# Altium project klor1_4.PrjPcb
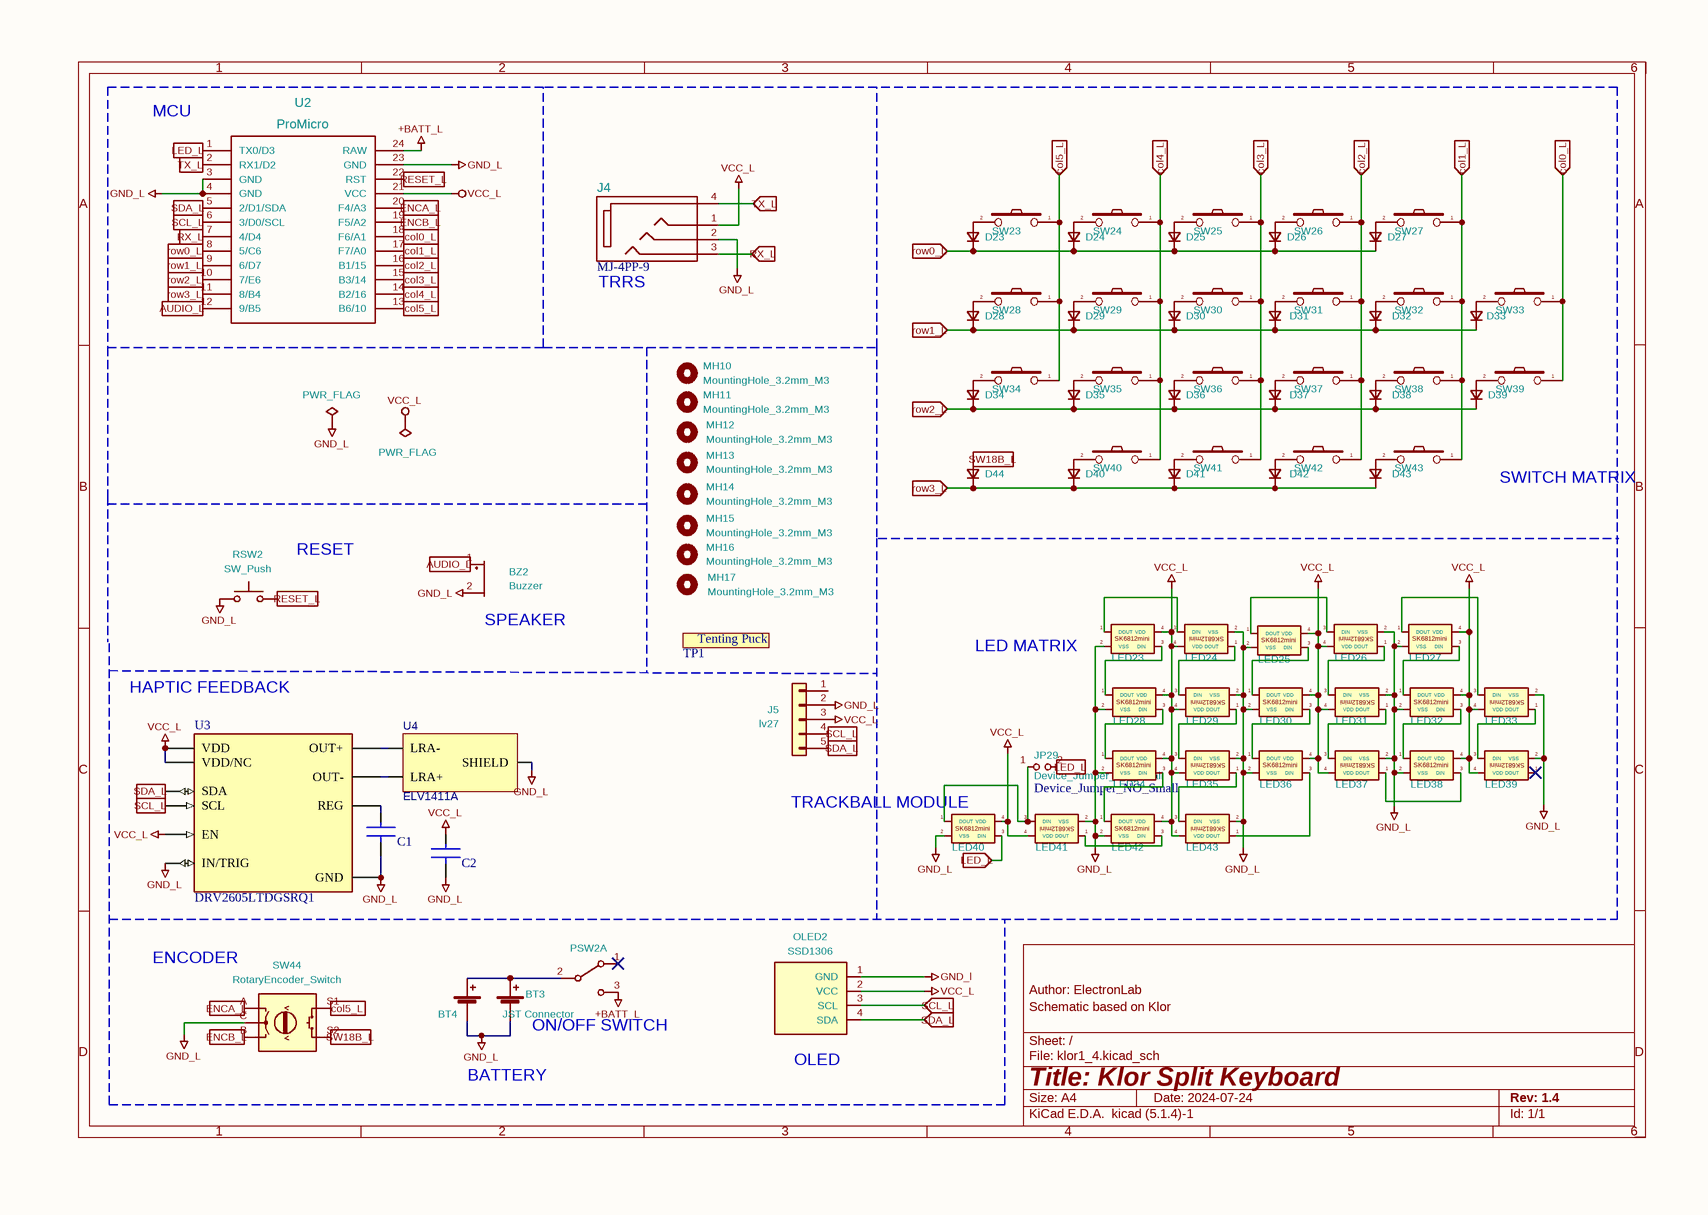
[diagram p0: klor1_4_L.SchDoc]
2 sheets, 178 parts. Net scope: flat (ports and power ports of the same name join across sheets).
Board file: klor1_4.PcbDoc
Sheets:
  klor1_4_L.SchDoc
  klor1_4_R.SchDoc

## Sheet klor1_4_L.SchDoc
size 297 x 209 mm

### Parts
#FLG01#1  PWR_FLAG  (graphical)
#FLG02#1  PWR_FLAG  (graphical)
BT3  JST Connector  [JST_PH_2PINS]
BT4  Battery_Cell  [custombatteryconnector_small]  (value not drawn)
BZ2  Buzzer  [Buzzer_Mallory_AST1109MLTRQ_reversible]
C1  Capacitor  [FP-C0402-BB-MFG]  (value not drawn)
C2  Capacitor  [FP-C0402-BB-MFG]  (value not drawn)
D23  D_Small  [Diode_SOD123]  (value not drawn)
D24  D_Small  [Diode_SOD123]  (value not drawn)
D25  D_Small  [Diode_SOD123]  (value not drawn)
D26  D_Small  [Diode_SOD123]  (value not drawn)
D27  D_Small  [Diode_SOD123]  (value not drawn)
D28  D_Small  [Diode_SOD123]  (value not drawn)
D29  D_Small  [Diode_SOD123]  (value not drawn)
D30  D_Small  [Diode_SOD123]  (value not drawn)
D31  D_Small  [Diode_SOD123]  (value not drawn)
D32  D_Small  [Diode_SOD123]  (value not drawn)
D33  D_Small  [Diode_SOD123]  (value not drawn)
D34  D_Small  [Diode_SOD123]  (value not drawn)
D35  D_Small  [Diode_SOD123]  (value not drawn)
D36  D_Small  [Diode_SOD123]  (value not drawn)
D37  D_Small  [Diode_SOD123]  (value not drawn)
D38  D_Small  [Diode_SOD123]  (value not drawn)
D39  D_Small  [Diode_SOD123]  (value not drawn)
D40  D_Small  [Diode_SOD123]  (value not drawn)
D41  D_Small  [Diode_SOD123]  (value not drawn)
D42  D_Small  [Diode_SOD123]  (value not drawn)
D43  D_Small  [Diode_SOD123]  (value not drawn)
D44  D_Small  [Diode_SOD123]  (value not drawn)
J4  MJ-4PP-9  [MJ-4PP-9]
J5  value lv27  [lvc27_onlyInput]  (hidden comment: lv2)
JP29  Device_Jumper_NO_Small  [SolderJumper-2_P1.3mm_Open_TrianglePad1.0x1.5mm]
LED23  SK6812MINI-E  [SK6812MINI-E]  (value not drawn)
LED24  SK6812MINI-E  [SK6812MINI-E]  (value not drawn)
LED25  SK6812MINI-E  [SK6812MINI-E]  (value not drawn)
LED26  SK6812MINI-E  [SK6812MINI-E]  (value not drawn)
LED27  SK6812MINI-E  [SK6812MINI-E]  (value not drawn)
LED28  SK6812MINI-E  [SK6812MINI-E]  (value not drawn)
LED29  SK6812MINI-E  [SK6812MINI-E]  (value not drawn)
LED30  SK6812MINI-E  [SK6812MINI-E]  (value not drawn)
LED31  SK6812MINI-E  [SK6812MINI-E]  (value not drawn)
LED32  SK6812MINI-E  [SK6812MINI-E]  (value not drawn)
LED33  SK6812MINI-E  [SK6812MINI-E]  (value not drawn)
LED34  SK6812MINI-E  [SK6812MINI-E]  (value not drawn)
LED35  SK6812MINI-E  [SK6812MINI-E]  (value not drawn)
LED36  SK6812MINI-E  [SK6812MINI-E]  (value not drawn)
LED37  SK6812MINI-E  [SK6812MINI-E]  (value not drawn)
LED38  SK6812MINI-E  [SK6812MINI-E]  (value not drawn)
LED39  SK6812MINI-E  [SK6812MINI-E]  (value not drawn)
LED40  SK6812MINI-E  [SK6812MINI-E]  (value not drawn)
LED41  SK6812MINI-E  [SK6812MINI-E]  (value not drawn)
LED42  SK6812MINI-E  [SK6812MINI-E]  (value not drawn)
LED43  SK6812MINI-E  [SK6812MINI-E]  (value not drawn)
MH10  MountingHole_3.2mm_M3  [MountingHole_3.2mm_M3]
MH11  MountingHole_3.2mm_M3  [MountingHole_3.2mm_M3]
MH12  MountingHole_3.2mm_M3  [MountingHole_3.2mm_M3]
MH13  MountingHole_3.2mm_M3  [MountingHole_3.2mm_M3]
MH14  MountingHole_3.2mm_M3  [MountingHole_3.2mm_M3]
MH15  MountingHole_3.2mm_M3  [MountingHole_3.2mm_M3]
MH16  MountingHole_3.2mm_M3  [MountingHole_3.2mm_M3]
MH17  MountingHole_3.2mm_M3  [MountingHole_3.2mm_M3]
OLED2  SSD1306  [SSD1306_128x64OLED]
PSW2  SW_DPDT_x2  [SW_MSK12C02]  (value not drawn)  (part A of 2)
RSW2  SW_Push  [SW_Push_1P1T-MP_NO_Horizontal_Alps_SKRTLAE010_both_sides]
SW23  SW_PUSH-MX  [CHERRY-CPG151101S11]  (value not drawn)
SW24  SW_PUSH-MX  [CHERRY-CPG151101S11]  (value not drawn)
SW25  SW_PUSH-MX  [CHERRY-CPG151101S11]  (value not drawn)
SW26  SW_PUSH-MX  [CHERRY-CPG151101S11]  (value not drawn)
SW27  SW_PUSH-MX  [CHERRY-CPG151101S11]  (value not drawn)
SW28  SW_PUSH-MX  [CHERRY-CPG151101S11]  (value not drawn)
SW29  SW_PUSH-MX  [CHERRY-CPG151101S11]  (value not drawn)
SW30  SW_PUSH-MX  [CHERRY-CPG151101S11]  (value not drawn)
SW31  SW_PUSH-MX  [CHERRY-CPG151101S11]  (value not drawn)
SW32  SW_PUSH-MX  [CHERRY-CPG151101S11]  (value not drawn)
SW33  SW_PUSH-MX  [CHERRY-CPG151101S11]  (value not drawn)
SW34  SW_PUSH-MX  [CHERRY-CPG151101S11]  (value not drawn)
SW35  SW_PUSH-MX  [CHERRY-CPG151101S11]  (value not drawn)
SW36  SW_PUSH-MX  [CHERRY-CPG151101S11]  (value not drawn)
SW37  SW_PUSH-MX  [CHERRY-CPG151101S11]  (value not drawn)
SW38  SW_PUSH-MX  [CHERRY-CPG151101S11]  (value not drawn)
SW39  SW_PUSH-MX  [CHERRY-CPG151101S11]  (value not drawn)
SW40  SW_PUSH-MX  [CHERRY-CPG151101S11]  (value not drawn)
SW41  SW_PUSH-MX  [CHERRY-CPG151101S11]  (value not drawn)
SW42  SW_PUSH-MX  [CHERRY-CPG151101S11]  (value not drawn)
SW43  SW_PUSH-MX  [CHERRY-CPG151101S11]  (value not drawn)
SW44  RotaryEncoder_Switch  [RotaryEncoder_Alps_EC11E-Switch_Vertical_H20mm-keebio_modified]
TP1  tenting-puck  [SplitkbTentingPuckWithoutCenterHole]  (value not drawn)
U2  ProMicro  [ProMicro]
U3  DRV2605LTDGSRQ1  [FP-DGS0010A-MFG]
U4  ELV1411A  [SMD-16_ELV1411A]

### Ports
AUDIO_L (in), col0_L (in), col1_L (in), col2_L (in), col3_L (in), col4_L (in), col5_L (in), ENCA_L (in), ENCB_L (in), LED_L (in), RESET_L (in), row0_L (in), row1_L (in), row2_L (in), row3_L (in), RX_L (in), SCL_L (in), SDA_L (in), SW18B_L (in), TX_L (in)

### Nets
+BATT_L: PSW2.3(C) U2.24(RAW)
GND_L: #FLG01#1.1(pwr) BT3.2(-) BT4.2(-) BZ2.2(+) C1.2 C2.2 J4.2 J5.2(Pin_2) LED23.2(VSS) LED24.2(VSS) LED25.2(VSS) LED26.2(VSS) LED27.2(VSS) LED28.2(VSS) LED29.2(VSS) LED30.2(VSS) LED31.2(VSS) LED32.2(VSS) LED33.2(VSS) LED34.2(VSS) LED35.2(VSS) LED36.2(VSS) LED37.2(VSS) LED38.2(VSS) LED39.2(VSS) LED40.2(VSS) LED41.2(VSS) LED42.2(VSS) LED43.2(VSS) OLED2.1(GND) RSW2.1 SW44.C U2.3(GND) U2.4(GND) U2.23(GND) U3.4(IN/TRIG) U3.8(GND) U4.5,6,7,8,9,10,11,12,13,14,15,16(SHIELD)
VCC_L: #FLG02#1.1(pwr) C2.1 J4.1 J5.3(Pin_3) LED23.4(VDD) LED24.4(VDD) LED25.4(VDD) LED26.4(VDD) LED27.4(VDD) LED28.4(VDD) LED29.4(VDD) LED30.4(VDD) LED31.4(VDD) LED32.4(VDD) LED33.4(VDD) LED34.4(VDD) LED35.4(VDD) LED36.4(VDD) LED37.4(VDD) LED38.4(VDD) LED39.4(VDD) LED40.4(VDD) LED41.4(VDD) LED42.4(VDD) LED43.4(VDD) OLED2.2(VCC) U2.21(VCC) U3.5(EN) U3.6(VDD/NC) U3.10(VDD)
AUDIO_L: BZ2.1(-) U2.12(9/B5) ; port AUDIO_L
col0_L: SW33.1 SW39.1 U2.18(F6/A1) ; port col0_L
col1_L: SW27.1 SW32.1 SW38.1 SW43.1 U2.17(F7/A0) ; port col1_L
col2_L: SW26.1 SW31.1 SW37.1 SW42.1 U2.16(B1/15) ; port col2_L
col3_L: SW25.1 SW30.1 SW36.1 SW41.1 U2.15(B3/14) ; port col3_L
col4_L: SW24.1 SW29.1 SW35.1 SW40.1 U2.14(B2/16) ; port col4_L
col5_L: SW23.1 SW28.1 SW34.1 SW44.S1 U2.13(B6/10) ; port col5_L
ENCA_L: SW44.A U2.20(F4/A3) ; port ENCA_L
ENCB_L: SW44.B U2.19(F5/A2) ; port ENCB_L
LED_L: JP29.2 LED40.3(DIN) U2.1(TX0/D3) ; port LED_L
RESET_L: RSW2.2 U2.22(RST) ; port RESET_L
row0_L: D23.1(K) D24.1(K) D25.1(K) D26.1(K) D27.1(K) U2.8(5/C6) ; port row0_L
row1_L: D28.1(K) D29.1(K) D30.1(K) D31.1(K) D32.1(K) D33.1(K) U2.9(6/D7) ; port row1_L
row2_L: D34.1(K) D35.1(K) D36.1(K) D37.1(K) D38.1(K) D39.1(K) U2.10(7/E6) ; port row2_L
row3_L: D40.1(K) D41.1(K) D42.1(K) D43.1(K) D44.1(K) U2.11(8/B4) ; port row3_L
RX_L: J4.3 U2.7(4/D4) ; port RX_L
SCL_L: J5.4(Pin_4) OLED2.3(SCL) U2.6(3/D0/SCL) U3.2(SCL) ; port SCL_L
SDA_L: J5.5(Pin_5) OLED2.4(SDA) U2.5(2/D1/SDA) U3.3(SDA) ; port SDA_L
SW18B_L: D44.2(A) SW44.S2 ; port SW18B_L
TX_L: J4.4 U2.2(RX1/D2) ; port TX_L
NetBT3_1: BT3.1(+) BT4.1(+) PSW2.2(B)
NetC1_1: C1.1 U3.1(REG)
NetD23_2: D23.2(A) SW23.2
NetD24_2: D24.2(A) SW24.2
NetD25_2: D25.2(A) SW25.2
NetD26_2: D26.2(A) SW26.2
NetD27_2: D27.2(A) SW27.2
NetD28_2: D28.2(A) SW28.2
NetD29_2: D29.2(A) SW29.2
NetD30_2: D30.2(A) SW30.2
NetD31_2: D31.2(A) SW31.2
NetD32_2: D32.2(A) SW32.2
NetD33_2: D33.2(A) SW33.2
NetD34_2: D34.2(A) SW34.2
NetD35_2: D35.2(A) SW35.2
NetD36_2: D36.2(A) SW36.2
NetD37_2: D37.2(A) SW37.2
NetD38_2: D38.2(A) SW38.2
NetD39_2: D39.2(A) SW39.2
NetD40_2: D40.2(A) SW40.2
NetD41_2: D41.2(A) SW41.2
NetD42_2: D42.2(A) SW42.2
NetD43_2: D43.2(A) SW43.2
NetJP29_1: JP29.1 LED40.1(DOUT) LED41.3(DIN)
NetLED23_1: LED23.1(DOUT) LED24.3(DIN)
NetLED23_3: LED23.3(DIN) LED28.1(DOUT)
NetLED24_1: LED24.1(DOUT) LED29.3(DIN)
NetLED25_1: LED25.1(DOUT) LED26.3(DIN)
NetLED25_3: LED25.3(DIN) LED30.1(DOUT)
NetLED26_1: LED26.1(DOUT) LED31.3(DIN)
NetLED27_1: LED27.1(DOUT) LED33.3(DIN)
NetLED27_3: LED27.3(DIN) LED32.1(DOUT)
NetLED28_3: LED28.3(DIN) LED34.1(DOUT)
NetLED29_1: LED29.1(DOUT) LED35.3(DIN)
NetLED30_3: LED30.3(DIN) LED36.1(DOUT)
NetLED31_1: LED31.1(DOUT) LED37.3(DIN)
NetLED32_3: LED32.3(DIN) LED38.1(DOUT)
NetLED33_1: LED33.1(DOUT) LED39.3(DIN)
NetLED34_3: LED34.3(DIN) LED42.1(DOUT)
NetLED35_1: LED35.1(DOUT) LED43.3(DIN)
NetLED36_3: LED36.3(DIN) LED43.1(DOUT)
NetLED37_1: LED37.1(DOUT) LED38.3(DIN)
NetLED41_1: LED41.1(DOUT) LED42.3(DIN)
NetU3_7: U3.7(OUT+) U4.1,2(LRA-)
NetU3_9: U3.9(OUT-) U4.3,4(LRA+)

Not connected (* = marked no-connect by the designer): J5 1(Pin_1); LED39 1(DOUT)*; PSW2 1(A)*

### Notes on the sheet
- MCU
- TRRS
- SWITCH
  MATRIX
- (near RSW2) RESET
- (near BZ2) SPEAKER
- (near U3) HAPTIC FEEDBACK
- LED
  MATRIX
- (near LED40) TRACKBALL
  MODULE
- ENCODER
- BATTERY
- ON/OFF SWITCH
- (near OLED2) OLED
- 1
- 2
- 3
- 4
- 5
- 6
- A
- B
- C
- Schematic based on Klor
- Author: ElectronLab
- D
- Title: Klor Split Keyboard
- File: klor1_4.kicad_sch
- Sheet: /
- KiCad E.D.A.  kicad (5.1.4)-1
- Size: A4
- Date: 2024-07-24
- Rev: 1.4
- Id: 1/1
- (in symbol LED-SK6812MINI-E) SK6812mini
- (in symbol tenting-puck) Tenting Puck

### Library data of the parts
BT3 = Battery_Cell: Conn Shrouded Header (4 Sides) HDR 2 POS 2mm Solder RA Side Entry Thru-Hole Box; Manufacturer Part Number: S2B-PH-K-S(LF)(SN); Value: JST Connector; Footprint: KLOR:JST_PH_reversible; Supplier: LCSC; Supplier Part Number: C173752; Manufacturer: JST; ComponentLink1URL: https://datasheet.octopart.com:443/S2B-PH-K-S%28LF%29%28SN%29-JST-datasheet-180491669.pdf?src-supplier=IHS; ComponentLink1Description: https://datasheet.octopart.com:443/S2B-PH-K-S%28LF%29%28SN%29-JST-datasheet-180491669.pdf?src-supplier=IHS; ComponentLink2URL: https://datasheet.octopart.com:443/S2B-PH-K-S%28LF%29%28SN%29-JST-datasheet-10411123.pdf?src-supplier=Upverter; ComponentLink2Description: https://datasheet.octopart.com:443/S2B-PH-K-S%28LF%29%28SN%29-JST-datasheet-10411123.pdf?src-supplier=Upverter; ComponentLink3URL: https://datasheet.octopart.com:443/S2B-PH-K-S%28LF%29%28SN%29-JST-datasheet-8324864.pdf?src-supplier=Upverter; ComponentLink3Description: https://datasheet.octopart.com:443/S2B-PH-K-S%28LF%29%28SN%29-JST-datasheet-8324864.pdf?src-supplier=Upverter; ComponentLink4URL: https://datasheet.octopart.com:443/S2B-PH-K-S%28LF%29%28SN%29-JST-datasheet-56537.pdf?src-supplier=Upverter; ComponentLink4Description: https://datasheet.octopart.com:443/S2B-PH-K-S%28LF%29%28SN%29-JST-datasheet-56537.pdf?src-supplier=Upverter; ComponentLink5URL: https://datasheet.octopart.com:443/S2B-PH-K-S%28LF%29%28SN%29-JST-datasheet-15068535.pdf?src-supplier=Upverter; ComponentLink5Description: https://datasheet.octopart.com:443/S2B-PH-K-S%28LF%29%28SN%29-JST-datasheet-15068535.pdf?src-supplier=Upverter; ComponentLink6URL: https://datasheet.octopart.com:443/S2B-PH-K-S%28LF%29%28SN%29-JST-datasheet-147762421.pdf?src-supplier=LKR; ComponentLink6Description: https://datasheet.octopart.com:443/S2B-PH-K-S%28LF%29%28SN%29-JST-datasheet-147762421.pdf?src-supplier=LKR; ComponentLink7URL: https://datasheet.octopart.com:443/S2B-PH-K-S%28LF%29%28SN%29-JST-datasheet-12510261.pdf?src-supplier=Future+Electronics; ComponentLink7Description: https://datasheet.octopart.com:443/S2B-PH-K-S%28LF%29%28SN%29-JST-datasheet-12510261.pdf?src-supplier=Future+Electronics
BZ2 = Buzzer: 70dB Passive (external drive) Piezoelectric SMD, 9x11mm Buzzers ROHS; Manufacturer: KELIKING; Value: Buzzer; Footprint: KLOR:Buzzer_Mallory_AST1109MLTRQ_reversible; Supplier: LCSC; Supplier Part Number: C201047; Manufacturer Part Number: KLJ-1102; Category: Uncategorized; Stock: 1162; Pricing: 1=0.6575, 10=0.5231, 30=0.4559, 100=0.3887, 500=0.3488, 1000=0.328 (USD)
C1 C2 = Capacitor: Manufacturer: CCTC; Manufacturer Part Number: TCC0402X5R105M100AT; Category: Ceramic Capacitors; Supplier Part Number: C2887020; Supplier: LCSC
D23-D44 = D_Small: Switching Diodes (Small Signal) SOD123 IR=5μA Io=150mA; Manufacturer: Slkor; Manufacturer Part Number: 1N4148W; Value: D_Small; Footprint: KLOR:Diode_SOD123; Supplier: LCSC; Supplier Part Number: C444720; Category: Rectifier Diodes; Stock: 1538400; Pricing: 100=0.006, 1000=0.0047, 3000=0.0037, 9000=0.0033, 51000=0.0031, 99000=0.003 (USD)
J4 = MJ-4PP-9 TRRS: -20⊥~+70⊥ 3.5mm Headphone Jack 235⊥ 30V 500mA Plugin Audio Connectors (Headphones) ROHS; Manufacturer: XKB Connectivity; Manufacturer Part Number: PJ-320A; Supplier: LCSC; Supplier Part Number: C22459514; Category: Uncategorized; JLCPCB Part #: C22459514
J5 = Conn_01x05: Footprint: KLOR:lvc27_onlyInput
JP29 = Device_Jumper_NO_Small: ki_fp_filters: SolderJumper*Open*; Value: Device_Jumper_NO_Small
LED23-LED43 = LED-SK6812MINI-E: Conn Shrouded Header (4 Sides) HDR 2 POS 2mm Solder RA Side Entry Thru-Hole Box; Manufacturer: DONGGUAN OCCIDENTAL OPTOELECTRONICS; Category: Uncategorized; Manufacturer Part Number: SK6812MINI-E; Supplier: LCSC; Supplier Part Number: C5149201
MH10-MH17 = MountingHole: Value: MountingHole_3.2mm_M3; Footprint: MountingHole:MountingHole_3.2mm_M3
PSW2 = SW_DPDT_x2: Slide Switches SPDT switch length: 8mm, switch width: 2.8mm; Manufacturer: SHOU HAN; Manufacturer Part Number: MSK12C02; Value: SW_DPDT_x2; Footprint: KLOR:MSK12C02_reversible; Supplier: LCSC; Supplier Part Number: C431540; Category: Uncategorized; Stock: 128790; Pricing: 10=0.0566, 100=0.0464, 300=0.0411, 3000=0.0353, 6000=0.0338, 9000=0.0328 (USD)
RSW2 = SW_Push: Tactile Switch, SKRT, Side Actuated, Surface Mount, Round Button, 160 gf, 50mA at 12VDC; Manufacturer: ALPSALPINE; Manufacturer Part Number: SKRTLAE010; Value: SW_Push; Footprint: KLOR:SW_Push_1P1T-MP_NO_Horizontal_Alps_SKRTLAE010_both_sides; Supplier: LCSC; Supplier Part Number: C110293; Category: Uncategorized; Stock: 34920; Pricing: 5=0.1324, 50=0.1079, 150=0.0956, 500=0.0864, 3000=0.0737, 6000=0.0701 (USD)
SW23-SW43 = SW_PUSH-MX_SOCKET: Manufacturer: HanElectricity; Manufacturer Part Number: CPG151101S11-16; Supplier: LCSC; Category: Uncategorized; Supplier Part Number: C41430893
SW44 = RotaryEncoder_Switch: Mechanical Encoder Rotary Incremental Flat 0.01N.m Straight Quadrature Digital Square Wave 15PPR Through Hole PC Pin...; Manufacturer: ALPSALPINE; Manufacturer Part Number: EC11N1525404; Value: RotaryEncoder_Switch; Footprint: KLOR:RotaryEncoder_Alps_EC11E-Switch_Vertical_H20mm-keebio_modified; Supplier: LCSC; Supplier Part Number: C470748; Category: Decoders and Multiplexers; Stock: 3732; Pricing: 1=2.7421, 10=2.3608, 30=2.1232, 120=1.7807, 480=1.6708, 960=1.6223, 2040=1.6046, 4800=1.5916 (USD)
U3 = DRV2605: IC MOTOR DRIVER 2V-5.2V 10VSSOP; Manufacturer: TI; Manufacturer Part Number: DRV2605LDGST; Logic Function: AND GATE; Min Supply Voltage: 2V; Max Supply Voltage: 5.2V; Quiescent Current: 500uA; Interface: I2C; Min Operating Temperature: -40°C; RoHS Compliant: Yes; Max Operating Temperature: 105°C; Case/Package: VSSOP; REACH SVHC: No SVHC; Packaging: Cut Tape; Number of Pins: 10; Mount: Surface Mount; Lead Free: Lead Free; Supplier Part Number: C425927; Supplier: LCSC
U4 = ELV1411A: 11mm x 14mm Rectangular Linear Vibration Motor Model NFP-ELV1411A-A1; Manufacturer: JLCPCB Assembly; Contributor: lcsc; Supplier: LCSC; JLCPCB Part Class: Extended Part; spicePre: U; spiceSymbolName: ELV1411A; Supplier Part Number: C9900029336; Manufacturer Part Number: ELV1411A
#FLG01#1 #FLG02#1 = PWR_FLAG: Value: PWR_FLAG
BT4 = Battery_Cell: Value: Battery_Cell; Footprint: KLOR:custombatteryconnector_small
OLED2 = SSD1306: Value: SSD1306; Footprint: KLOR:SSD1306_128x64OLED
U2 = ProMicro: Value: ProMicro; Footprint: KLOR:ProMicro

## Sheet klor1_4_R.SchDoc
size 297 x 209 mm
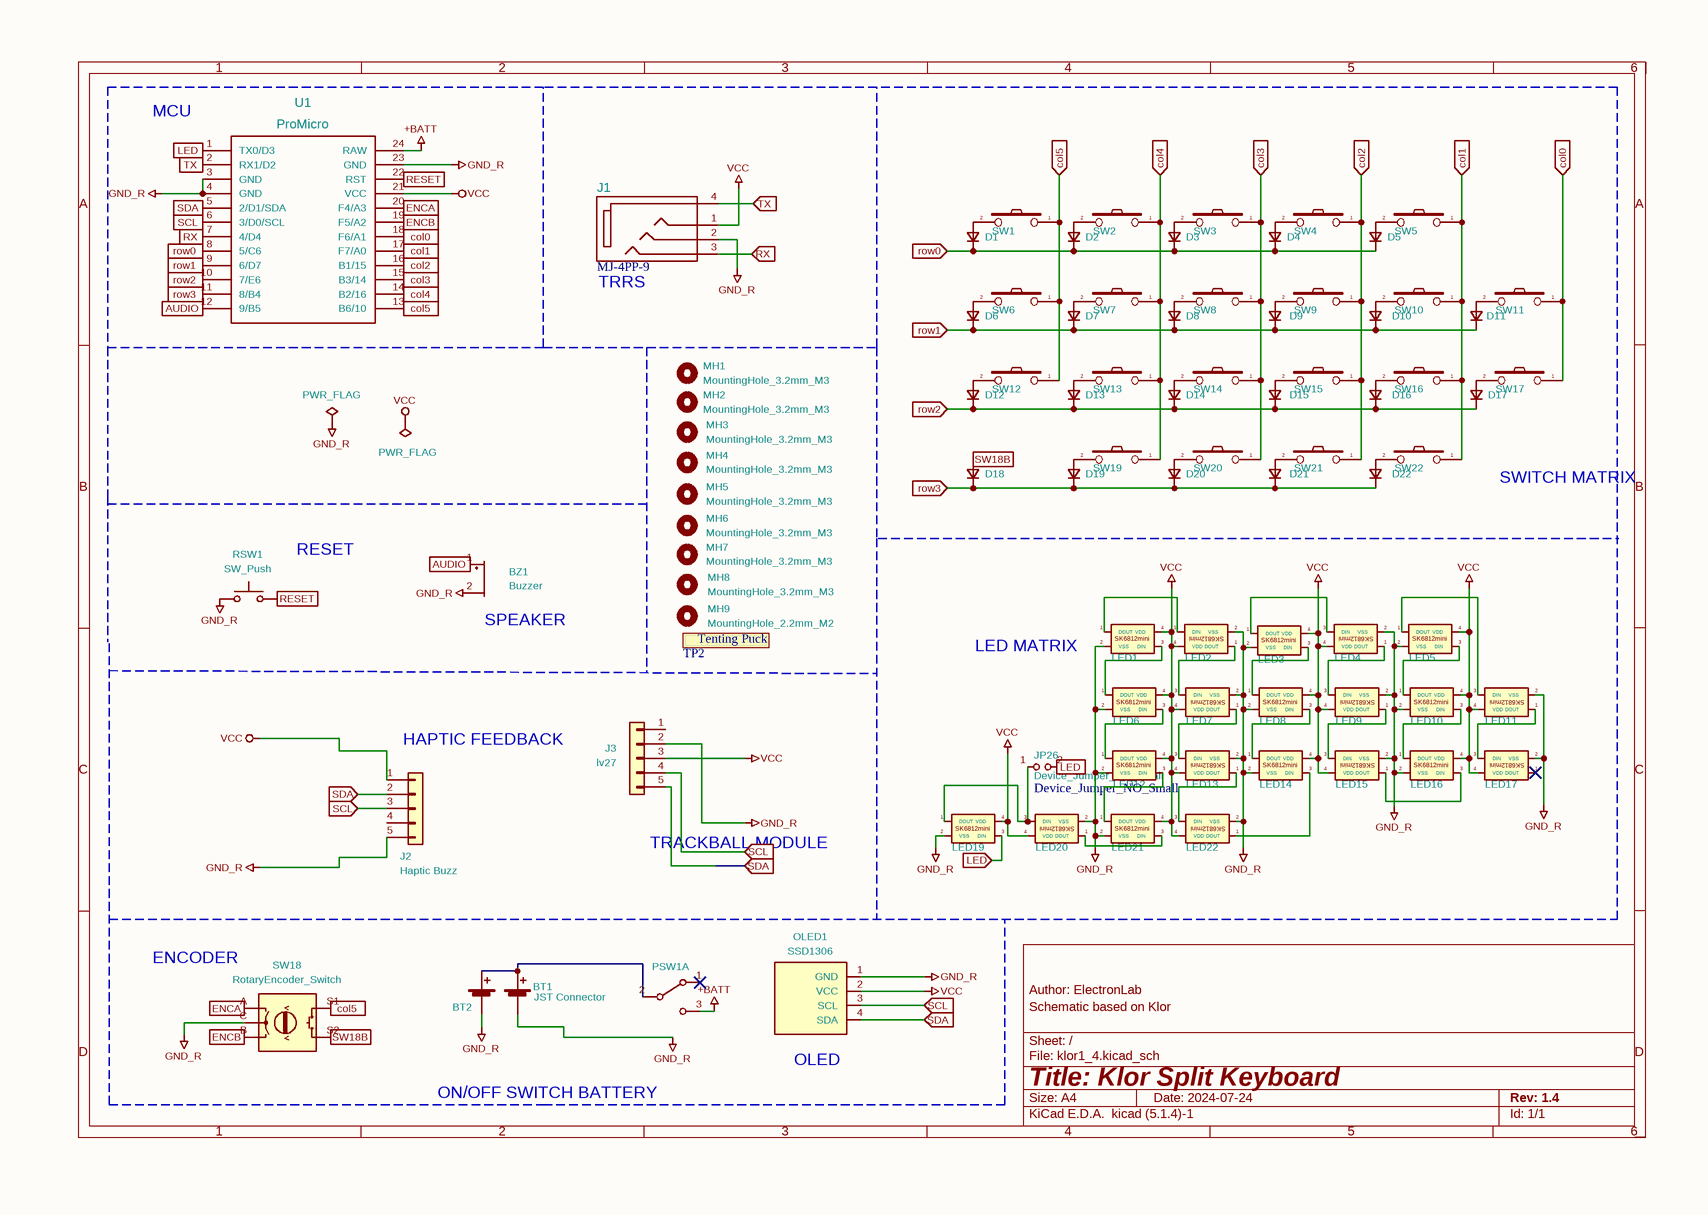
[diagram p1: klor1_4_R.SchDoc]

### Parts
#FLG01#2  PWR_FLAG  (graphical)
#FLG02#2  PWR_FLAG  (graphical)
BT1  JST Connector  [JST_PH_2PINS]
BT2  Battery_Cell  [custombatteryconnector_small]  (value not drawn)
BZ1  Buzzer  [Buzzer_Mallory_AST1109MLTRQ_reversible]
D1  D_Small  [Diode_SOD123]  (value not drawn)
D2  D_Small  [Diode_SOD123]  (value not drawn)
D3  D_Small  [Diode_SOD123]  (value not drawn)
D4  D_Small  [Diode_SOD123]  (value not drawn)
D5  D_Small  [Diode_SOD123]  (value not drawn)
D6  D_Small  [Diode_SOD123]  (value not drawn)
D7  D_Small  [Diode_SOD123]  (value not drawn)
D8  D_Small  [Diode_SOD123]  (value not drawn)
D9  D_Small  [Diode_SOD123]  (value not drawn)
D10  D_Small  [Diode_SOD123]  (value not drawn)
D11  D_Small  [Diode_SOD123]  (value not drawn)
D12  D_Small  [Diode_SOD123]  (value not drawn)
D13  D_Small  [Diode_SOD123]  (value not drawn)
D14  D_Small  [Diode_SOD123]  (value not drawn)
D15  D_Small  [Diode_SOD123]  (value not drawn)
D16  D_Small  [Diode_SOD123]  (value not drawn)
D17  D_Small  [Diode_SOD123]  (value not drawn)
D18  D_Small  [Diode_SOD123]  (value not drawn)
D19  D_Small  [Diode_SOD123]  (value not drawn)
D20  D_Small  [Diode_SOD123]  (value not drawn)
D21  D_Small  [Diode_SOD123]  (value not drawn)
D22  D_Small  [Diode_SOD123]  (value not drawn)
J1  MJ-4PP-9  [MJ-4PP-9]
J2  Haptic Buzz  [Pimoroni Haptic Buzz DRV2605L Driver]
J3  lv27  [lvc27_onlyInput]
JP26  Device_Jumper_NO_Small  [SolderJumper-2_P1.3mm_Open_TrianglePad1.0x1.5mm]
LED1  SK6812MINI-E  [SK6812MINI-E]  (value not drawn)
LED2  SK6812MINI-E  [SK6812MINI-E]  (value not drawn)
LED3  SK6812MINI-E  [SK6812MINI-E]  (value not drawn)
LED4  SK6812MINI-E  [SK6812MINI-E]  (value not drawn)
LED5  SK6812MINI-E  [SK6812MINI-E]  (value not drawn)
LED6  SK6812MINI-E  [SK6812MINI-E]  (value not drawn)
LED7  SK6812MINI-E  [SK6812MINI-E]  (value not drawn)
LED8  SK6812MINI-E  [SK6812MINI-E]  (value not drawn)
LED9  SK6812MINI-E  [SK6812MINI-E]  (value not drawn)
LED10  SK6812MINI-E  [SK6812MINI-E]  (value not drawn)
LED11  SK6812MINI-E  [SK6812MINI-E]  (value not drawn)
LED12  SK6812MINI-E  [SK6812MINI-E]  (value not drawn)
LED13  SK6812MINI-E  [SK6812MINI-E]  (value not drawn)
LED14  SK6812MINI-E  [SK6812MINI-E]  (value not drawn)
LED15  SK6812MINI-E  [SK6812MINI-E]  (value not drawn)
LED16  SK6812MINI-E  [SK6812MINI-E]  (value not drawn)
LED17  SK6812MINI-E  [SK6812MINI-E]  (value not drawn)
LED19  SK6812MINI-E  [SK6812MINI-E]  (value not drawn)
LED20  SK6812MINI-E  [SK6812MINI-E]  (value not drawn)
LED21  SK6812MINI-E  [SK6812MINI-E]  (value not drawn)
LED22  SK6812MINI-E  [SK6812MINI-E]  (value not drawn)
MH1  MountingHole_3.2mm_M3  [MountingHole_3.2mm_M3]
MH2  MountingHole_3.2mm_M3  [MountingHole_3.2mm_M3]
MH3  MountingHole_3.2mm_M3  [MountingHole_3.2mm_M3]
MH4  MountingHole_3.2mm_M3  [MountingHole_3.2mm_M3]
MH5  MountingHole_3.2mm_M3  [MountingHole_3.2mm_M3]
MH6  MountingHole_3.2mm_M3  [MountingHole_3.2mm_M3]
MH7  MountingHole_3.2mm_M3  [MountingHole_3.2mm_M3]
MH8  MountingHole_3.2mm_M3  [MountingHole_3.2mm_M3]
MH9  MountingHole_2.2mm_M2  [MountingHole_2.2mm_M2]
OLED1  SSD1306  [SSD1306_128x64OLED]
PSW1  SW_DPDT_x2  [SW_MSK12C02]  (value not drawn)  (part A of 2)
RSW1  SW_Push  [SW_Push_1P1T-MP_NO_Horizontal_Alps_SKRTLAE010_both_sides]
SW1  SW_PUSH-MX  [CHERRY-CPG151101S11]  (value not drawn)
SW2  SW_PUSH-MX  [CHERRY-CPG151101S11]  (value not drawn)
SW3  SW_PUSH-MX  [CHERRY-CPG151101S11]  (value not drawn)
SW4  SW_PUSH-MX  [CHERRY-CPG151101S11]  (value not drawn)
SW5  SW_PUSH-MX  [CHERRY-CPG151101S11]  (value not drawn)
SW6  SW_PUSH-MX  [CHERRY-CPG151101S11]  (value not drawn)
SW7  SW_PUSH-MX  [CHERRY-CPG151101S11]  (value not drawn)
SW8  SW_PUSH-MX  [CHERRY-CPG151101S11]  (value not drawn)
SW9  SW_PUSH-MX  [CHERRY-CPG151101S11]  (value not drawn)
SW10  SW_PUSH-MX  [CHERRY-CPG151101S11]  (value not drawn)
SW11  SW_PUSH-MX  [CHERRY-CPG151101S11]  (value not drawn)
SW12  SW_PUSH-MX  [CHERRY-CPG151101S11]  (value not drawn)
SW13  SW_PUSH-MX  [CHERRY-CPG151101S11]  (value not drawn)
SW14  SW_PUSH-MX  [CHERRY-CPG151101S11]  (value not drawn)
SW15  SW_PUSH-MX  [CHERRY-CPG151101S11]  (value not drawn)
SW16  SW_PUSH-MX  [CHERRY-CPG151101S11]  (value not drawn)
SW17  SW_PUSH-MX  [CHERRY-CPG151101S11]  (value not drawn)
SW18  RotaryEncoder_Switch  [RotaryEncoder_Alps_EC11E-Switch_Vertical_H20mm-keebio_modified]
SW19  SW_PUSH-MX  [CHERRY-CPG151101S11]  (value not drawn)
SW20  SW_PUSH-MX  [CHERRY-CPG151101S11]  (value not drawn)
SW21  SW_PUSH-MX  [CHERRY-CPG151101S11]  (value not drawn)
SW22  SW_PUSH-MX  [CHERRY-CPG151101S11]  (value not drawn)
TP2  tenting-puck  [SplitkbTentingPuckWithoutCenterHole]  (value not drawn)
U1  ProMicro  [ProMicro]

### Ports
AUDIO (in), col0 (in), col1 (in), col2 (in), col3 (in), col4 (in), col5 (in), ENCA (in), ENCB (in), LED (in), RESET (in), row0 (in), row1 (in), row2 (in), row3 (in), RX (in), SCL (in), SDA (in), SW18B (in), TX (in)

### Nets
+BATT: PSW1.3(C) U1.24(RAW)
GND_R: #FLG01#2.1(pwr) BT1.2(-) BT2.2(-) BZ1.2(+) J1.2 J2.5(Pin_5) J3.2(Pin_2) LED1.2(VSS) LED2.2(VSS) LED3.2(VSS) LED4.2(VSS) LED5.2(VSS) LED6.2(VSS) LED7.2(VSS) LED8.2(VSS) LED9.2(VSS) LED10.2(VSS) LED11.2(VSS) LED12.2(VSS) LED13.2(VSS) LED14.2(VSS) LED15.2(VSS) LED16.2(VSS) LED17.2(VSS) LED19.2(VSS) LED20.2(VSS) LED21.2(VSS) LED22.2(VSS) OLED1.1(GND) RSW1.1 SW18.C U1.3(GND) U1.4(GND) U1.23(GND)
VCC: #FLG02#2.1(pwr) J1.1 J2.1(Pin_1) J3.3(Pin_3) LED1.4(VDD) LED2.4(VDD) LED3.4(VDD) LED4.4(VDD) LED5.4(VDD) LED6.4(VDD) LED7.4(VDD) LED8.4(VDD) LED9.4(VDD) LED10.4(VDD) LED11.4(VDD) LED12.4(VDD) LED13.4(VDD) LED14.4(VDD) LED15.4(VDD) LED16.4(VDD) LED17.4(VDD) LED19.4(VDD) LED20.4(VDD) LED21.4(VDD) LED22.4(VDD) OLED1.2(VCC) U1.21(VCC)
AUDIO: BZ1.1(-) U1.12(9/B5) ; port AUDIO
col0: SW11.1 SW17.1 U1.18(F6/A1) ; port col0
col1: SW5.1 SW10.1 SW16.1 SW22.1 U1.17(F7/A0) ; port col1
col2: SW4.1 SW9.1 SW15.1 SW21.1 U1.16(B1/15) ; port col2
col3: SW3.1 SW8.1 SW14.1 SW20.1 U1.15(B3/14) ; port col3
col4: SW2.1 SW7.1 SW13.1 SW19.1 U1.14(B2/16) ; port col4
col5: SW1.1 SW6.1 SW12.1 SW18.S1 U1.13(B6/10) ; port col5
ENCA: SW18.A U1.20(F4/A3) ; port ENCA
ENCB: SW18.B U1.19(F5/A2) ; port ENCB
LED: JP26.2 LED19.3(DIN) U1.1(TX0/D3) ; port LED
RESET: RSW1.2 U1.22(RST) ; port RESET
row0: D1.1(K) D2.1(K) D3.1(K) D4.1(K) D5.1(K) U1.8(5/C6) ; port row0
row1: D6.1(K) D7.1(K) D8.1(K) D9.1(K) D10.1(K) D11.1(K) U1.9(6/D7) ; port row1
row2: D12.1(K) D13.1(K) D14.1(K) D15.1(K) D16.1(K) D17.1(K) U1.10(7/E6) ; port row2
row3: D18.1(K) D19.1(K) D20.1(K) D21.1(K) D22.1(K) U1.11(8/B4) ; port row3
RX: J1.3 U1.7(4/D4) ; port RX
SCL: J2.3(Pin_3) J3.4(Pin_4) OLED1.3(SCL) U1.6(3/D0/SCL) ; port SCL
SDA: J2.2(Pin_2) J3.5(Pin_5) OLED1.4(SDA) U1.5(2/D1/SDA) ; port SDA
SW18B: D18.2(A) SW18.S2 ; port SW18B
TX: J1.4 U1.2(RX1/D2) ; port TX
NetBT1_1: BT1.1(+) BT2.1(+) PSW1.2(B)
NetD1_2: D1.2(A) SW1.2
NetD2_2: D2.2(A) SW2.2
NetD3_2: D3.2(A) SW3.2
NetD4_2: D4.2(A) SW4.2
NetD5_2: D5.2(A) SW5.2
NetD6_2: D6.2(A) SW6.2
NetD7_2: D7.2(A) SW7.2
NetD8_2: D8.2(A) SW8.2
NetD9_2: D9.2(A) SW9.2
NetD10_2: D10.2(A) SW10.2
NetD11_2: D11.2(A) SW11.2
NetD12_2: D12.2(A) SW12.2
NetD13_2: D13.2(A) SW13.2
NetD14_2: D14.2(A) SW14.2
NetD15_2: D15.2(A) SW15.2
NetD16_2: D16.2(A) SW16.2
NetD17_2: D17.2(A) SW17.2
NetD19_2: D19.2(A) SW19.2
NetD20_2: D20.2(A) SW20.2
NetD21_2: D21.2(A) SW21.2
NetD22_2: D22.2(A) SW22.2
NetJP26_1: JP26.1 LED19.1(DOUT) LED20.3(DIN)
NetLED1_1: LED1.1(DOUT) LED2.3(DIN)
NetLED1_3: LED1.3(DIN) LED6.1(DOUT)
NetLED2_1: LED2.1(DOUT) LED7.3(DIN)
NetLED3_1: LED3.1(DOUT) LED4.3(DIN)
NetLED3_3: LED3.3(DIN) LED8.1(DOUT)
NetLED4_1: LED4.1(DOUT) LED9.3(DIN)
NetLED5_1: LED5.1(DOUT) LED11.3(DIN)
NetLED5_3: LED5.3(DIN) LED10.1(DOUT)
NetLED6_3: LED6.3(DIN) LED12.1(DOUT)
NetLED7_1: LED7.1(DOUT) LED13.3(DIN)
NetLED8_3: LED8.3(DIN) LED14.1(DOUT)
NetLED9_1: LED9.1(DOUT) LED15.3(DIN)
NetLED10_3: LED10.3(DIN) LED16.1(DOUT)
NetLED11_1: LED11.1(DOUT) LED17.3(DIN)
NetLED12_3: LED12.3(DIN) LED21.1(DOUT)
NetLED13_1: LED13.1(DOUT) LED22.3(DIN)
NetLED14_3: LED14.3(DIN) LED22.1(DOUT)
NetLED15_1: LED15.1(DOUT) LED16.3(DIN)
NetLED20_1: LED20.1(DOUT) LED21.3(DIN)

Not connected (* = marked no-connect by the designer): J2 4(Pin_4); J3 1(Pin_1); LED17 1(DOUT)*; PSW1 1(A)*

### Notes on the sheet
- MCU
- TRRS
- SWITCH
  MATRIX
- (near RSW1) RESET
- (near BZ1) SPEAKER
- LED
  MATRIX
- (near J2) HAPTIC
  FEEDBACK
- (near J3) TRACKBALL
  MODULE
- ENCODER
- (near OLED1) OLED
- ON/OFF SWITCH
  BATTERY
- 1
- 2
- 3
- 4
- 5
- 6
- A
- B
- C
- Schematic based on Klor
- Author: ElectronLab
- D
- Title: Klor Split Keyboard
- File: klor1_4.kicad_sch
- Sheet: /
- KiCad E.D.A.  kicad (5.1.4)-1
- Size: A4
- Date: 2024-07-24
- Rev: 1.4
- Id: 1/1
- (in symbol LED-SK6812MINI-E) SK6812mini
- (in symbol tenting-puck) Tenting Puck

### Library data of the parts
BT1 = Battery_Cell: as BT3 on sheet klor1_4_L; Value: JST Connector; Footprint: KLOR:JST_PH_reversible; Supplier: LCSC; Supplier Part Number: C173752; Manufacturer: JST; ComponentLink1URL: https://datasheet.octopart.com:443/S2B-PH-K-S%28LF%29%28SN%29-JST-datasheet-180491669.pdf?src-supplier=IHS; ComponentLink1Description: https://datasheet.octopart.com:443/S2B-PH-K-S%28LF%29%28SN%29-JST-datasheet-180491669.pdf?src-supplier=IHS; ComponentLink2URL: https://datasheet.octopart.com:443/S2B-PH-K-S%28LF%29%28SN%29-JST-datasheet-10411123.pdf?src-supplier=Upverter; ComponentLink2Description: https://datasheet.octopart.com:443/S2B-PH-K-S%28LF%29%28SN%29-JST-datasheet-10411123.pdf?src-supplier=Upverter; ComponentLink3URL: https://datasheet.octopart.com:443/S2B-PH-K-S%28LF%29%28SN%29-JST-datasheet-8324864.pdf?src-supplier=Upverter; ComponentLink3Description: https://datasheet.octopart.com:443/S2B-PH-K-S%28LF%29%28SN%29-JST-datasheet-8324864.pdf?src-supplier=Upverter; ComponentLink4URL: https://datasheet.octopart.com:443/S2B-PH-K-S%28LF%29%28SN%29-JST-datasheet-56537.pdf?src-supplier=Upverter; ComponentLink4Description: https://datasheet.octopart.com:443/S2B-PH-K-S%28LF%29%28SN%29-JST-datasheet-56537.pdf?src-supplier=Upverter; ComponentLink5URL: https://datasheet.octopart.com:443/S2B-PH-K-S%28LF%29%28SN%29-JST-datasheet-15068535.pdf?src-supplier=Upverter; ComponentLink5Description: https://datasheet.octopart.com:443/S2B-PH-K-S%28LF%29%28SN%29-JST-datasheet-15068535.pdf?src-supplier=Upverter; ComponentLink6URL: https://datasheet.octopart.com:443/S2B-PH-K-S%28LF%29%28SN%29-JST-datasheet-147762421.pdf?src-supplier=LKR; ComponentLink6Description: https://datasheet.octopart.com:443/S2B-PH-K-S%28LF%29%28SN%29-JST-datasheet-147762421.pdf?src-supplier=LKR; ComponentLink7URL: https://datasheet.octopart.com:443/S2B-PH-K-S%28LF%29%28SN%29-JST-datasheet-12510261.pdf?src-supplier=Future+Electronics; ComponentLink7Description: https://datasheet.octopart.com:443/S2B-PH-K-S%28LF%29%28SN%29-JST-datasheet-12510261.pdf?src-supplier=Future+Electronics
BZ1 = Buzzer: as BZ2 on sheet klor1_4_L; Value: Buzzer; Footprint: KLOR:Buzzer_Mallory_AST1109MLTRQ_reversible; Supplier: LCSC; Supplier Part Number: C201047; Manufacturer Part Number: KLJ-1102; Category: Uncategorized; Stock: 1162; Pricing: 1=0.6575, 10=0.5231, 30=0.4559, 100=0.3887, 500=0.3488, 1000=0.328 (USD)
D1-D22 = D_Small: as D23 on sheet klor1_4_L; Value: D_Small; Footprint: KLOR:Diode_SOD123; Supplier: LCSC; Supplier Part Number: C444720; Category: Rectifier Diodes; Stock: 1538400; Pricing: 100=0.006, 1000=0.0047, 3000=0.0037, 9000=0.0033, 51000=0.0031, 99000=0.003 (USD)
J1 = MJ-4PP-9 TRRS: as J4 on sheet klor1_4_L; Supplier: LCSC; Supplier Part Number: C22459514; Category: Uncategorized; JLCPCB Part #: C22459514
J2 J3 = Conn_01x05
  J2: Value: Haptic Buzz; Footprint: KLOR:Pimoroni Haptic Buzz DRV2605L Driver
  J3: Value: lv27; Footprint: KLOR:lvc27_onlyInput
JP26 = Device_Jumper_NO_Small: ki_fp_filters: SolderJumper*Open*; Value: Device_Jumper_NO_Small
LED1-LED17 LED19-LED22 = LED-SK6812MINI-E: as LED23 on sheet klor1_4_L; Category: Uncategorized; Manufacturer Part Number: SK6812MINI-E; Supplier: LCSC; Supplier Part Number: C5149201
MH1-MH9 = MountingHole
  MH1-MH8: Value: MountingHole_3.2mm_M3; Footprint: MountingHole:MountingHole_3.2mm_M3
  MH9: Value: MountingHole_2.2mm_M2; Footprint: MountingHole:MountingHole_2.2mm_M2
PSW1 = SW_DPDT_x2: as PSW2 on sheet klor1_4_L; Value: SW_DPDT_x2; Footprint: KLOR:MSK12C02_reversible; Supplier: LCSC; Supplier Part Number: C431540; Category: Uncategorized; Stock: 128790; Pricing: 10=0.0566, 100=0.0464, 300=0.0411, 3000=0.0353, 6000=0.0338, 9000=0.0328 (USD)
RSW1 = SW_Push: as RSW2 on sheet klor1_4_L; Value: SW_Push; Footprint: KLOR:SW_Push_1P1T-MP_NO_Horizontal_Alps_SKRTLAE010_both_sides; Supplier: LCSC; Supplier Part Number: C110293; Category: Uncategorized; Stock: 34920; Pricing: 5=0.1324, 50=0.1079, 150=0.0956, 500=0.0864, 3000=0.0737, 6000=0.0701 (USD)
SW1-SW17 SW19-SW22 = SW_PUSH-MX_SOCKET: as SW23 on sheet klor1_4_L; Supplier: LCSC; Category: Uncategorized; Supplier Part Number: C41430893
SW18 = RotaryEncoder_Switch: as SW44 on sheet klor1_4_L; Value: RotaryEncoder_Switch; Footprint: KLOR:RotaryEncoder_Alps_EC11E-Switch_Vertical_H20mm-keebio_modified; Supplier: LCSC; Supplier Part Number: C470748; Category: Decoders and Multiplexers; Stock: 3732; Pricing: 1=2.7421, 10=2.3608, 30=2.1232, 120=1.7807, 480=1.6708, 960=1.6223, 2040=1.6046, 4800=1.5916 (USD)
#FLG01#2 #FLG02#2 = PWR_FLAG: Value: PWR_FLAG
BT2 = Battery_Cell: Value: Battery_Cell; Footprint: KLOR:custombatteryconnector_small
OLED1 = SSD1306: Value: SSD1306; Footprint: KLOR:SSD1306_128x64OLED
U1 = ProMicro: Value: ProMicro; Footprint: KLOR:ProMicro